# Altium schematic sheet mcu.SchDoc
size A4
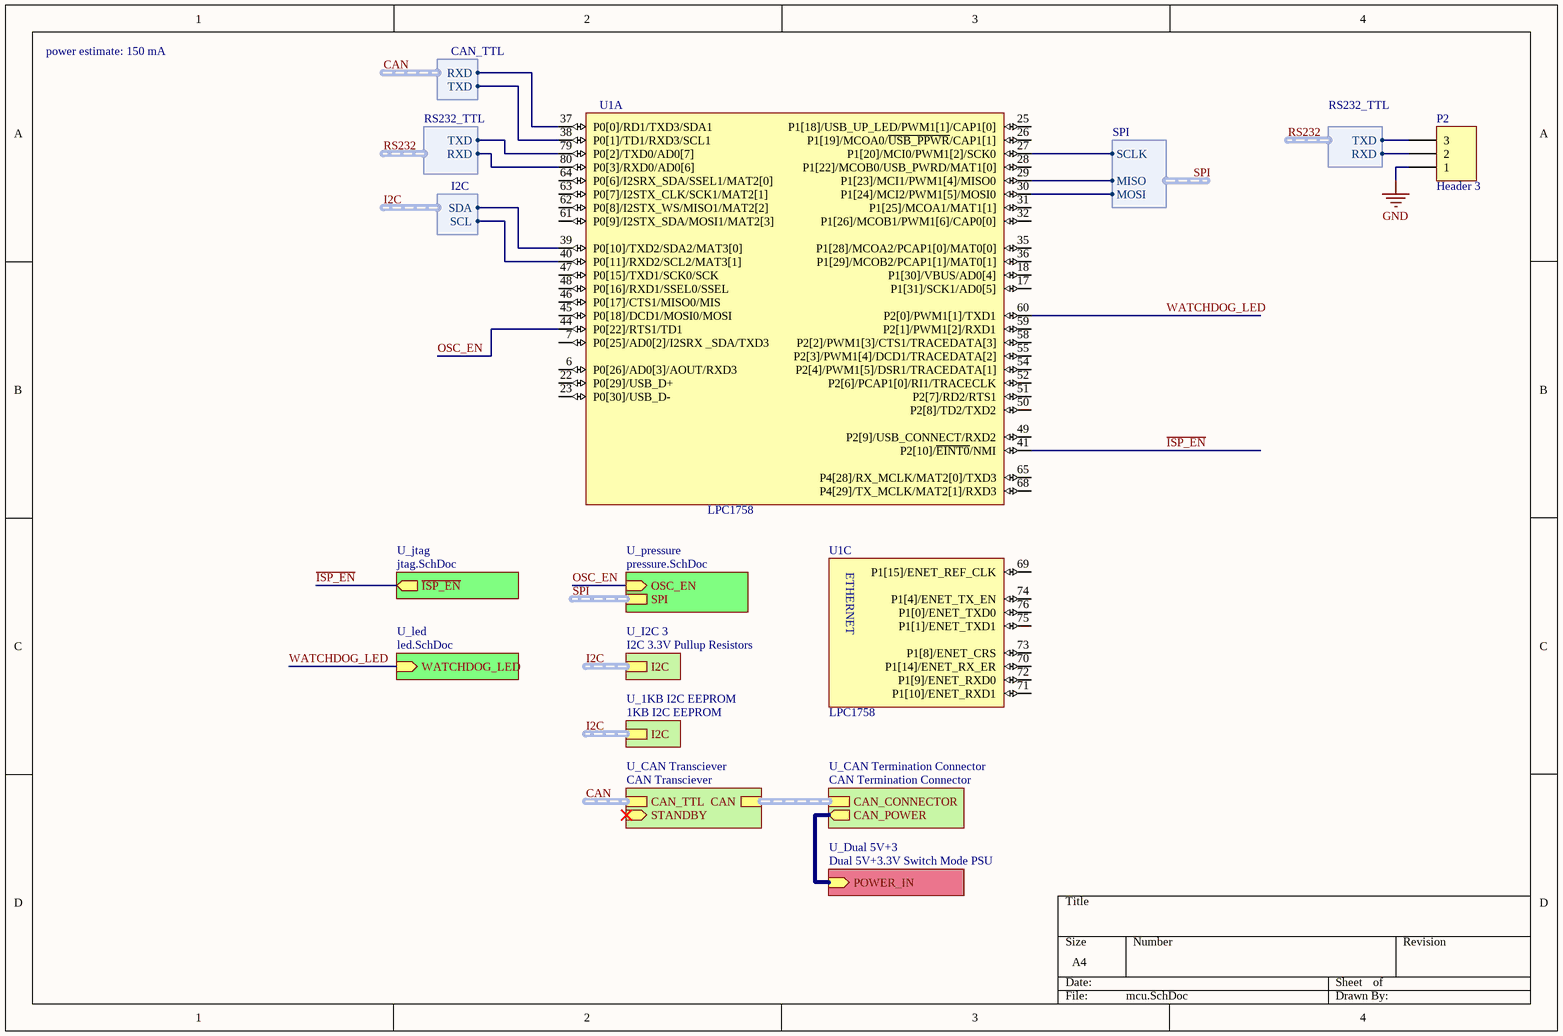
[diagram p0: mcu.SchDoc]

## Parts
P2  Header 3  [HDR1X3]
U1  LPC1758  [LPC1758FBD80]  (parts A,C of 3)

## Sub-sheets
U_1KB I2C EEPROM = 1KB I2C EEPROM: I2C (harness I2C)
U_CAN Termination Connector = CAN Termination Connector: CAN_CONNECTOR (harness CAN), CAN_POWER (out)
U_CAN Transciever = CAN Transciever: CAN_TTL (harness CAN_TTL), CAN (harness CAN), STANDBY (in)
U_Dual 5V+3 = Dual 5V+3.3V Switch Mode PSU: POWER_IN (in)
U_I2C 3 = I2C 3.3V Pullup Resistors: I2C (harness I2C)
U_jtag = jtag.SchDoc: ~{ISP_EN} (out)
U_led = led.SchDoc: WATCHDOG_LED (in)
U_pressure = pressure.SchDoc: SPI (harness SPI), OSC_EN (in)

## Harnesses
SPI: MISO, MOSI, SCLK
CAN_TTL: RXD, TXD
I2C: SCL, SDA
RS232_TTL: RXD, TXD

## Nets
GND: P2.1
CAN.RXD: U1.37(P0[0]/RD1/TXD3/SDA1) ; sheet U_CAN Transciever/CAN_TTL.RXD
CAN.TXD: U1.38(P0[1]/TD1/RXD3/SCL1) ; sheet U_CAN Transciever/CAN_TTL.TXD
I2C.SCL: U1.40(P0[11]/RXD2/SCL2/MAT3[1]) ; sheet U_I2C 3/I2C.SCL
I2C.SDA: U1.39(P0[10]/TXD2/SDA2/MAT3[0]) ; sheet U_I2C 3/I2C.SDA
~{ISP_EN}: U1.41(P2[10]/~{EINT0}/NMI) ; sheet U_jtag/~{ISP_EN}
OSC_EN: U1.44(P0[22]/RTS1/TD1) ; sheet U_pressure/OSC_EN
RS232.RXD: P2.2 U1.80(P0[3]/RXD0/AD0[6]) ; harness RS232_TTL.RXD
RS232.TXD: P2.3 U1.79(P0[2]/TXD0/AD0[7]) ; harness RS232_TTL.TXD
SPI.MISO: U1.29(P1[23]/MCI1/PWM1[4]/MISO0) ; sheet U_pressure/SPI.MISO
SPI.MOSI: U1.30(P1[24]/MCI2/PWM1[5]/MOSI0) ; sheet U_pressure/SPI.MOSI
SPI.SCLK: U1.27(P1[20]/MCI0/PWM1[2]/SCK0) ; sheet U_pressure/SPI.SCLK
WATCHDOG_LED: U1.60(P2[0]/PWM1[1]/TXD1) ; sheet U_led/WATCHDOG_LED
(unnamed): sheet U_CAN Termination Connector/CAN_POWER, sheet U_Dual 5V+3/POWER_IN

Not connected (* = marked no-connect by the designer): U1 6(P0[26]/AD0[3]/AOUT/RXD3) 7(P0[25]/AD0[2]/I2SRX__SDA/TXD3) 17(P1[31]/SCK1/AD0[5]) 18(P1[30]/VBUS/AD0[4]) 22(P0[29]/USB_D+) 23(P0[30]/USB_D-) 25(P1[18]/USB_UP_LED/PWM1[1]/CAP1[0]) 26(P1[19]/MCOA0/~{USB_PPWR}/CAP1[1]) 28(P1[22]/MCOB0/USB_PWRD/MAT1[0]) 31(P1[25]/MCOA1/MAT1[1]) 32(P1[26]/MCOB1/PWM1[6]/CAP0[0]) 35(P1[28]/MCOA2/PCAP1[0]/MAT0[0]) 36(P1[29]/MCOB2/PCAP1[1]/MAT0[1]) 45(P0[18]/DCD1/MOSI0/MOSI) 46(P0[17]/CTS1/MISO0/MIS) 47(P0[15]/TXD1/SCK0/SCK) 48(P0[16]/RXD1/SSEL0/SSEL) 49(P2[9]/USB_CONNECT/RXD2) 50(P2[8]/TD2/TXD2) 51(P2[7]/RD2/RTS1) 52(P2[6]/PCAP1[0]/RI1/TRACECLK) 54(P2[4]/PWM1[5]/DSR1/TRACEDATA[1]) 55(P2[3]/PWM1[4]/DCD1/TRACEDATA[2]) 58(P2[2]/PWM1[3]/CTS1/TRACEDATA[3]) 59(P2[1]/PWM1[2]/RXD1) 61(P0[9]/I2STX_SDA/MOSI1/MAT2[3]) 62(P0[8]/I2STX_WS/MISO1/MAT2[2]) 63(P0[7]/I2STX_CLK/SCK1/MAT2[1]) 64(P0[6]/I2SRX_SDA/SSEL1/MAT2[0]) 65(P4[28]/RX_MCLK/MAT2[0]/TXD3) 68(P4[29]/TX_MCLK/MAT2[1]/RXD3) 69(P1[15]/ENET_REF_CLK) 70(P1[14]/ENET_RX_ER) 71(P1[10]/ENET_RXD1) 72(P1[9]/ENET_RXD0) 73(P1[8]/ENET_CRS) 74(P1[4]/ENET_TX_EN) 75(P1[1]/ENET_TXD1) 76(P1[0]/ENET_TXD0)

## Buses and harness runs
harness CAN = sheet U_CAN Transciever/CAN_TTL
harness I2C = sheet U_1KB I2C EEPROM/I2C
harness I2C = sheet U_I2C 3/I2C
harness sheet U_CAN Termination Connector/CAN_CONNECTOR = sheet U_CAN Transciever/CAN
harness SPI = sheet U_pressure/SPI

## Notes on the sheet
- power estimate: 150 mA
- (in symbol LPC1758, part C) ETHERNET

## Library data of the parts
P2 = Header 3: Header, 3-Pin; LatestRevisionDate: 17-Jul-2002; LatestRevisionNote: Re-released for DXP Platform.; Publisher: Altium Limited
U1 = LPC1758: NXP - LPC1758FBD80 - MCU, 32BIT, ARM CORTEX M3, 80LQFP; farnell: 1718545